# Altium schematic sheet TempSenseConditioning.SchDoc
size A4; Organization: UltraZohm; DocumentNumber: 5; SheetNumber: 11; SheetTotal: 11; Website: www.ultrazohm.com
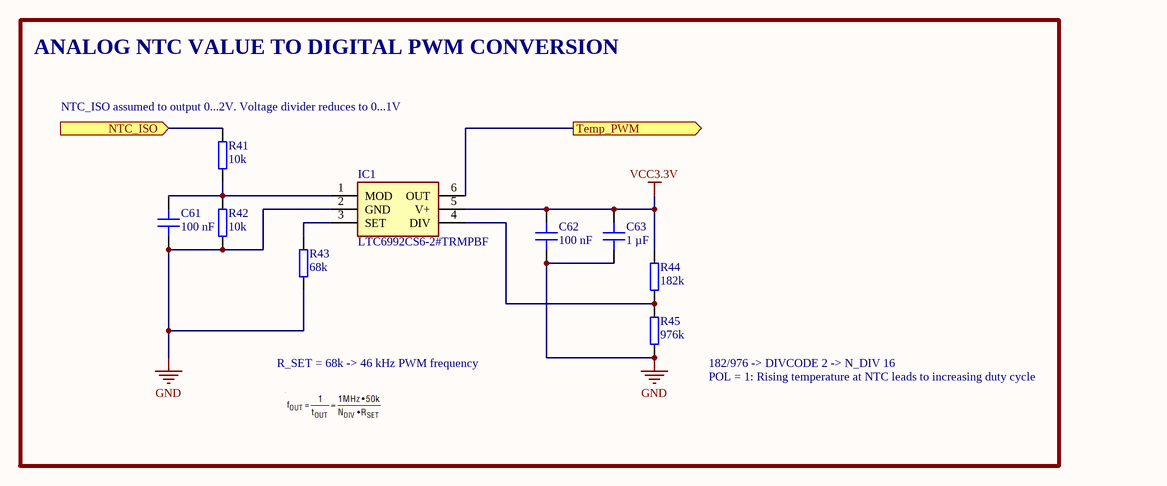
[diagram p0: TempSenseConditioning.SchDoc]

## Parts
C61  100 nF  [C_0603]
C62  100 nF  [C_0603]
C63  1 µF  [C_0603]
IC1  LTC6992CS6-2#TRMPBF  [SOT95P280X100-6N]
R41  10k  [RES 0603_1608]
R42  10k  [RES 0603_1608]
R43  68k  [RES 0603_1608]
R44  182k  [RES 0603_1608]
R45  976k  [RES 0603_1608]

## Ports
NTC_ISO (in, see TopSheet[2C], Connector_Inverter[2B]), Temp_PWM (out, see TopSheet[2C])

## Nets
GND: C61.2 C62.2 C63.2 IC1.2(GND) R42.1 R43.1 R45.1
VCC3.3V: C62.1 C63.1 IC1.5(V+) R44.2
NTC_ISO: R41.2 ; port NTC_ISO
Temp_PWM: IC1.6(OUT) ; port Temp_PWM
NetC61_1: C61.1 IC1.1(MOD) R41.1 R42.2
NetIC1_3: IC1.3(SET) R43.2
NetIC1_4: IC1.4(DIV) R44.1 R45.2

## Notes on the sheet
- ANALOG NTC VALUE TO DIGITAL PWM CONVERSION
- (near R41) NTC_ISO assumed to output 0...2V. Voltage divider reduces to 0...1V
- R_SET = 68k -> 46 kHz PWM frequency
- 182/976 -> DIVCODE 2 -> N_DIV 16
- POL = 1: Rising temperature at NTC leads to increasing duty cycle
- Title
- Revision:
- Design Engineer:
- Date:
- Project:
- Sheet
- of

## Library data of the parts
C61 C62 = C0603C104K5RAC3121: Capacitor 0603, 50 VDC, 100nF, X7R; Manufacturer: KEMET; Tolerance: 10 %; Voltage Rating: 50 VDC; Created from: DHufnagel; Manufacturer Part Number: C0603C104K5RAC3121; PartID: 99; Created On: 11/08/2022 14:33:29; ComponentLink1Description: Datasheet; ComponentLink1URL: https://www.mouser.de/datasheet/2/212/KEM_C1023_X7R_AUTO_SMD-1093309.pdf; Component Type: Capacitor 0603; Device Package: 0603; Last Updated: 19/08/2022 08:26:58; Mounting Type: SMD; Operating Temperature: -55 - 125°C; Series: X7R; Supplier 1: Mouser; Supplier Part Number 1: 80-C603C104K5RAC3121; Supplier 2: LCSC; Supplier Part Number 2: C14663; Type: Capacitor; Value: 100 nF; Live Cycle Status: 1; LCSC Part Number: C14663; Stock number: not stored
C63 = C0603C105K3RAC7411: Capacitor 0603, 25 VDC, 1 µF, X7R; Manufacturer: KEMET; Tolerance: 10 %; Voltage Rating: 25 VDC; Created from: MGremer; Manufacturer Part Number: C0603C105K3RAC7411; PartID: 4; Created On: 20/12/2020 13:54:13; ComponentLink1Description: Datasheet; ComponentLink1URL: https://www.mouser.de/datasheet/2/212/KEM_C1002_X7R_SMD-1102033.pdf; Component Type: Capacitor 0603; Device Package: 0603; Last Updated: 20/12/2020 16:43:05; Mounting Type: SMD; Operating Temperature: -55 - 125°C; Series: SMD Comm X7R; Supplier 1: Mouser; Supplier Part Number 1: 80-C0603C105K3RLR; Type: Capacitor; Value: 1 µF; Live Cycle Status: 1; Stock number: Labor SMD Container; LCSC Part Number: C29936
IC1 = LTC6992CS6-2#TRMPBF: Switching Controllers PWM with 5% to 95% Pulse Width Control; Manufacturer: Analog Devices; Created from: MHoerner; Manufacturer Part Number: LTC6992CS6-2#TRMPBF; PartID: 12; Created On: 11.06.2026 14:34:57; ComponentLink1Description: Datasheet; ComponentLink1URL: https://www.mouser.de/datasheet/2/609/LTC6992-1-6992-2-6992-3-6992-4-1852873.pdf; Component Type: Switching Controllers; Device Package: SOT-23-6; Last Updated: 11.06.2026 14:34:57; Mounting Type: SMD; Operating Temperature: 0 to 70 °C; Supplier 1: Mouser; Supplier Part Number 1: 584-C6992CS6-2TRMPBF; Supplier 2: LCSC; Supplier Part Number 2: C581035; Type: Switching Controller; Live Cycle Status: 1; LCSC Part Number: C581035; Stock number: not stored
R41 R42 = RK73B1JTTD103J: SMD resistor E24 series; Manufacturer: KOA Speer; Tolerance: 5%; Created from: MGremer; Manufacturer Part Number: RK73B1JTTD103J; PartID: 98; Created On: 14.12.2020 16:17:14; ComponentLink1Description: Datasheet; ComponentLink1URL: https://www.mouser.de/datasheet/2/219/RK73B-1825463.pdf; Component Type: SMD resistor; Device Package: 0603; Last Updated: 27.05.2022 14:04:22; Mounting Type: SMD; Supplier 1: Mouser; Supplier Part Number 1: 660-RK73B1JTTD103J; Type: Resistor; Value: 10k; Live Cycle Status: 1; Stock number: Labor SMD Container; LCSC Part Number: C25804
R43 = AC0603FR-1068KL: SMD resistor 1%; Manufacturer: Yageo; Created from: MGremer; Manufacturer Part Number: AC0603FR-1068KL; PartID: 183; Created On: 14.12.2020 16:17:14; ComponentLink1Description: Datasheet; ComponentLink1URL: https://www.mouser.de/datasheet/2/447/PYu_AC_51_RoHS_L_7-1714230.pdf; Component Type: SMD resistor; Device Package: 0603; Last Updated: 21.05.2021 10:06:00; Mounting Type: SMD; Supplier 1: Mouser; Supplier Part Number 1: 603-AC0603FR-1068KL; Type: Resistor; Tolerance: 1%; Value: 68k; Live Cycle Status: 1; Stock number: not stored
R44 = CR0603-FX-1823ELF: SMD resistor 1%, 50V, 100ppm; Manufacturer: Bourns; Created from: DHufnagel; Manufacturer Part Number: CR0603-FX-1823ELF; PartID: 235; Created On: 25.07.2022 08:26:35; ComponentLink1Description: Datasheet; ComponentLink1URL: https://www.mouser.de/datasheet/2/54/cr-1858361.pdf; Component Type: SMD resistor; Device Package: 0603; Last Updated: 15.02.2023 18:09:14; Mounting Type: SMD; Supplier 1: Mouser; Supplier Part Number 1: 652-CR0603FX-1823ELF; Type: Resistor; Tolerance: 1%; Value: 182k; Live Cycle Status: 1; Stock number: not stored; LCSC Part Number: C203368
R45 = CR0603-FX-9763ELF: SMD resistor 1%, 50V, 100ppm; Manufacturer: Bourns; Created from: DHufnagel; Manufacturer Part Number: CR0603-FX-9763ELF; PartID: 234; Created On: 25.07.2022 08:26:35; ComponentLink1Description: Datasheet; ComponentLink1URL: https://www.mouser.de/datasheet/2/54/cr-1858361.pdf; Component Type: SMD resistor; Device Package: 0603; Last Updated: 15.02.2023 18:14:05; Mounting Type: SMD; Supplier 1: Mouser; Supplier Part Number 1: 652-CR0603FX-9763ELF; Type: Resistor; Tolerance: 1%; Value: 976k; Live Cycle Status: 1; Stock number: not stored; LCSC Part Number: C162980